# EasyEDA Pro project LNA模块20dB.eprj

# Schematic Schematic1
Board Name: Board1; Create Date: 2025-06-13; Page Name: P1; Project Name: LNA模块20dB; Schematic Name: Schematic1; Update Date: 2025-06-13; Company: 嘉立创EDA; Page Size: A4; Version: V1.0
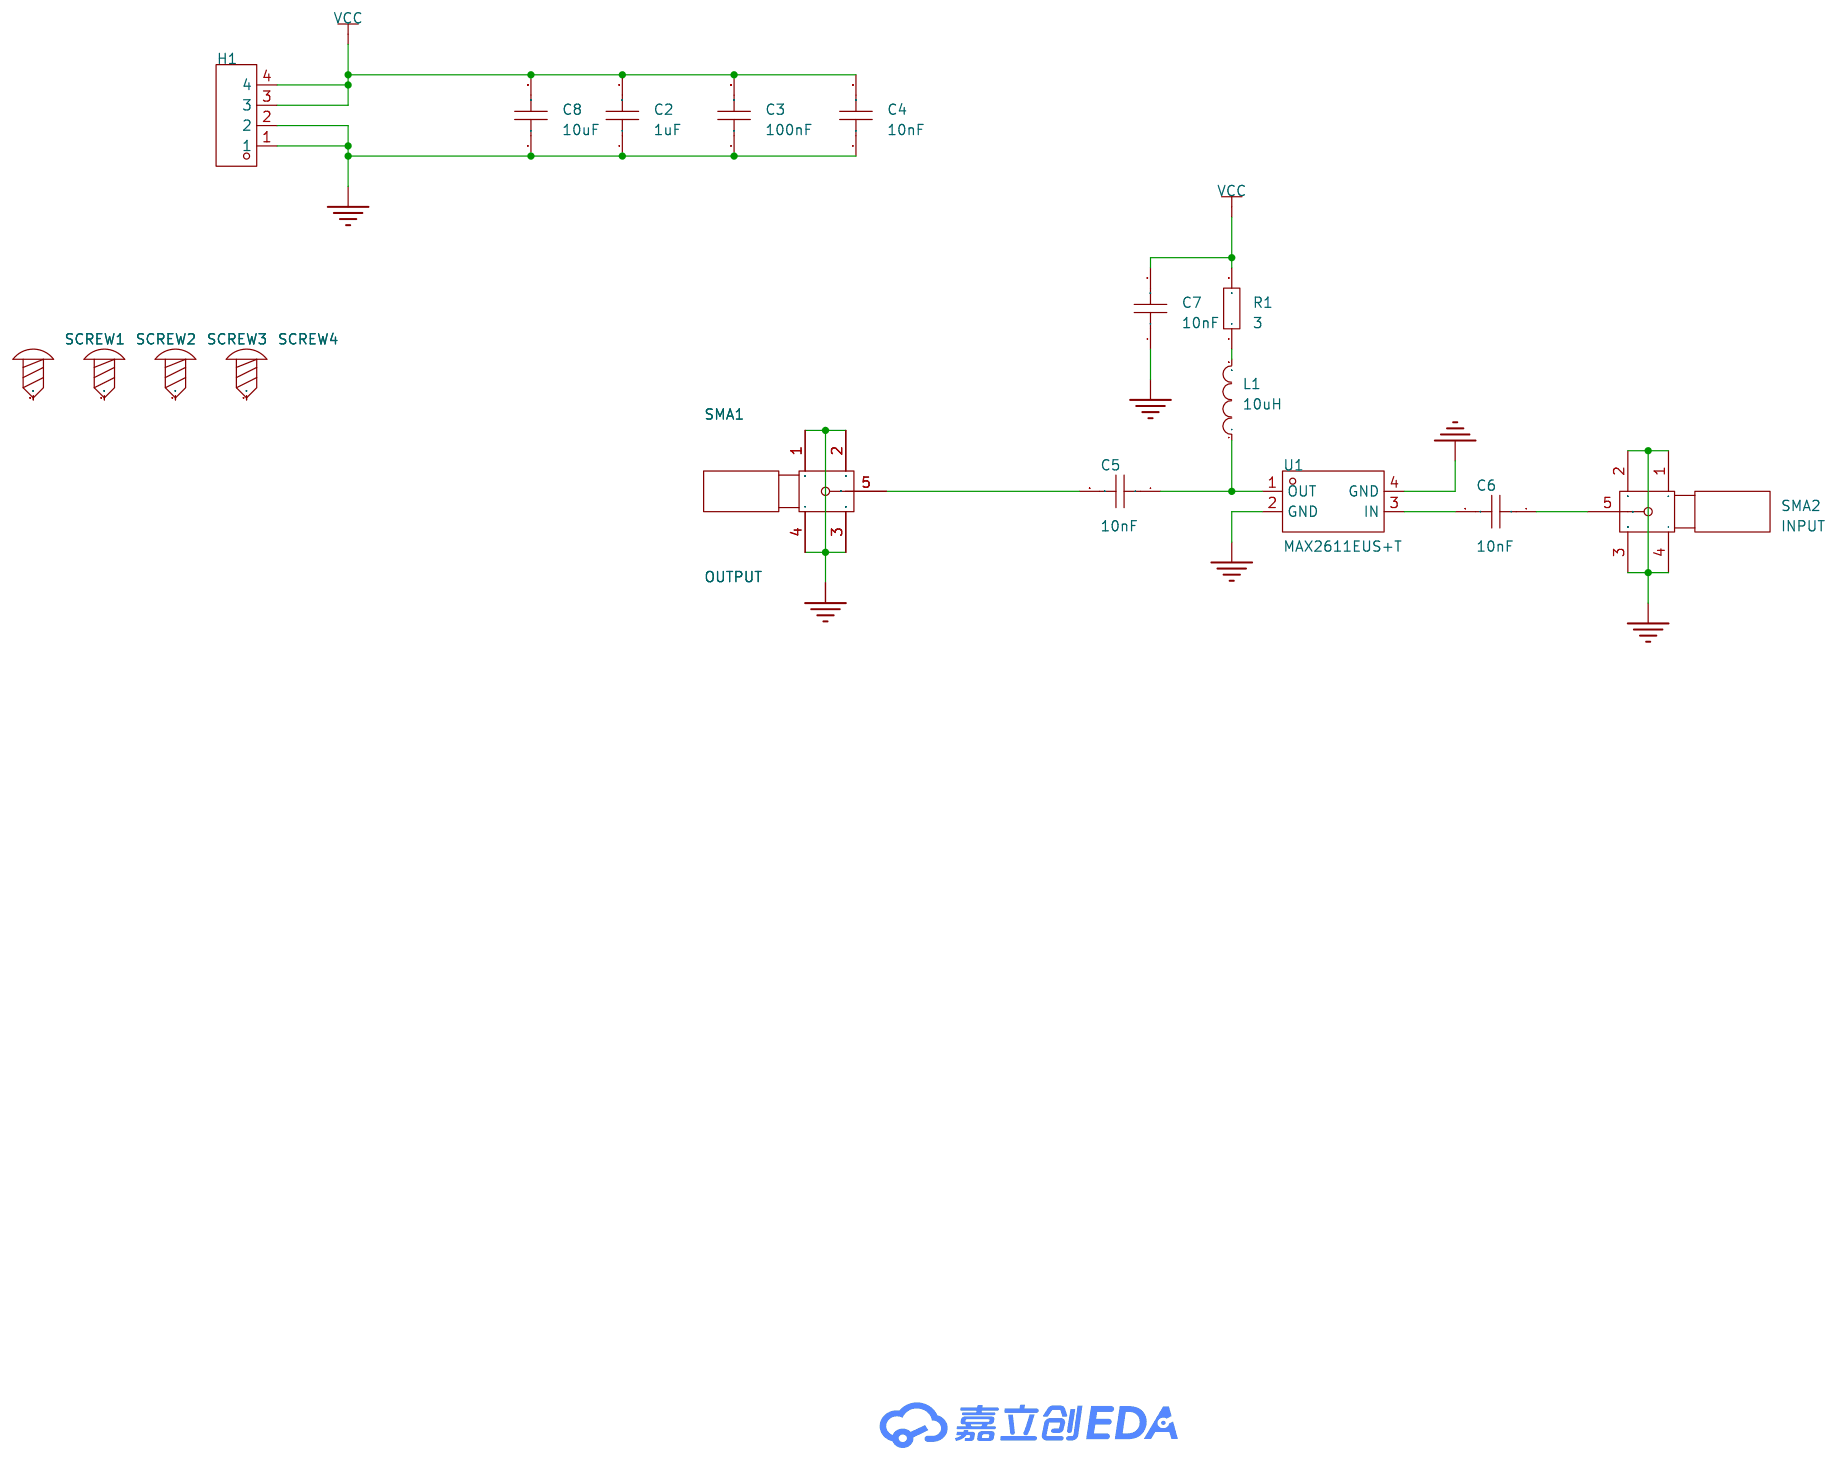
[diagram p0: schematic sheet]

## Parts
C2  1uF  [C0603]
C3  100nF  [C0603]
C4  10nF  [C0603]
C5  10nF  [C0603]
C6  10nF  [C0603]
C7  10nF  [C0603]
C8  10uF  [C0603]
H1  -  [HDR-TH_4P-P2.54-V-M]
L1  10uH  [L0603]
R1  3  [R0603]
SCREW1  -  [M2螺丝]
SCREW2  -  [M2螺丝]
SCREW3  -  [M2螺丝]
SCREW4  -  [M2螺丝]
SMA1  OUTPUT  [SMA-SMD_BWSMA-KE-P001]
SMA2  INPUT  [SMA-SMD_BWSMA-KE-P001]
U1  MAX2611EUS+T  [SOT-143-4_L2.9-W1.3-P1.92-LS2.4-BL]

## Library data of the parts
C2-C8 = CAP_0603: Supplier Footprint: 0603
H1 = HDR-M_2.54_1x4P: Supplier Part: C492403; Supplier Footprint: 插件
L1 = L_0603
R1 = Res_0603: Supplier Footprint: 0603
SCREW1-SCREW4 = M2螺丝: Supplier Footprint: 插件
SMA1 SMA2 = SMA: Supplier Part: C9900018296; JLCPCB Part Class: 扩展库; Supplier: LCSC
U1 = MAX2611EUS+T: 应用领域:GPS；WLL；机顶盒；ISM；PCS；WLAN;频率:0Hz~1.1GHz;增益:18.3dB;; LCSC Part Name: 直流至微波低噪声放大器; Supplier Part: C559510; Manufacturer: ADI(亚德诺)/MAXIM(美信); Supplier Footprint: SOT-143-4; JLCPCB Part Class: 扩展库; Datasheet: https://atta.szlcsc.com/upload/public/pdf/source/20221121/80FC9B3F2BA7D7E9490E24CACEDB6FF3.pdf; Supplier: LCSC; Applications: GPS；WLL；机顶盒；ISM；PCS；WLAN; Frequency Range: 0Hz~1.1GHz; Gain: 18.3dB; Voltage - Supply: 5V; Current - Supply: 16mA

## Nets
GND: C2.1 C3.1 C4.1 C7.1 C8.1 H1.1 H1.2 SMA1.1 SMA1.2 SMA1.3 SMA1.4 SMA2.1 SMA2.2 SMA2.3 SMA2.4 U1.2(GND) U1.4(GND)
VCC: C2.2 C3.2 C4.2 C7.2 C8.2 H1.3 H1.4 R1.2
$1N726: L1.2 R1.1
$1N735: C5.1 L1.1 U1.1(OUT)
$1N837: C6.2 U1.3(IN)
Net-(C5-2): C5.2 SMA1.5
Net-(C6-1): C6.1 SMA2.5

Not connected (* = marked no-connect by the designer): SCREW1 1; SCREW2 1; SCREW3 1; SCREW4 1

# Board PCB1
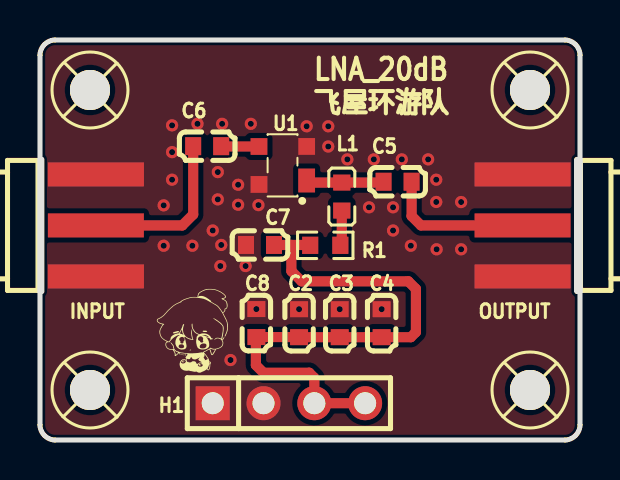
[diagram p1: board, top side]
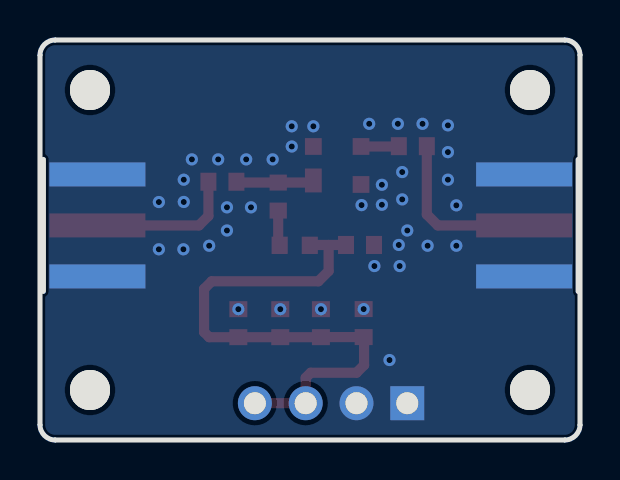
[diagram p2: board, bottom side, seen from below]

Outline 27 x 20 mm; copper layers: Top Layer, Bottom Layer. Coordinates in mm from the lower left corner of the outline.
Outline path: 0,19.24 0,0.76 arc(0.22,0.22) 0.76,0 26.24,0 arc(26.78,0.22) 27,0.76 27,19.24 arc(26.78,19.78) 26.24,20 0.76,20 arc(0.22,19.78) 0,19.24
Stack: Top Layer 0.035mm / Dielectric1 1.51mm FR4 er 4.5 / Bottom Layer 0.035mm

## Design rules (mm)
template: 自定义配置
spacing copperThickness1oz (default): track to track 0.102, other pairs 0.152 to 0.3
spacing copperThickness2oz: track to track 0.203, other pairs 0.152 to 0.3
track width copperThickness1oz (default): min 0.127, default 0.254, max 2.54
track width copperThickness2oz: min 0.203, default 0.254, max 2.54
differential pair differentialPair (default): width min 0.127, default 0.254, max 2.54; gap min 0.152, default 0.152
via viaSize (default): diameter min 0.5, default 0.61, max 10; hole min 0.3, default 0.305, max 6.3
pour e158 uses copperRegion
pour e232 uses copperRegion

## Placement (name value [footprint] x y rotation side)
C2  1uF  [C0603]  12.95 5.84 270 top
C3  100nF  [C0603]  14.99 5.84 270 top
C4  10nF  [C0603]  17.08 5.84 270 top
C5  10nF  [C0603]  17.88 12.91 0 top
C6  10nF  [C0603]  8.36 14.69 0 top
C7  10nF  [C0603]  11 9.75 0 top
C8  10uF  [C0603]  10.82 5.85 270 top
H1  -  [HDR-TH_4P-P2.54-V-M]  12.45 1.84 0 top
INPUT  INPUT  [SMA-SMD_BWSMA-KE-P001]  2.79 10.73 180 top
L1  10uH  [L0603]  15.09 12.17 270 top
OUTPUT  OUTPUT  [SMA-SMD_BWSMA-KE-P001]  24.13 10.73 0 top
R1  3  [R0603]  14.26 9.73 180 top
SCREW1  -  [M2螺丝]  2.5 17.5 0 top
SCREW2  -  [M2螺丝]  24.5 17.5 0 top
SCREW3  -  [M2螺丝]  2.5 2.5 0 top
SCREW4  -  [M2螺丝]  24.5 2.5 0 top
U1  MAX2611EUS+T  [SOT-143-4_L2.9-W1.3-P1.92-LS2.4-BL]  12.14 13.73 90 top

## Footprints (pads in the part's own frame, mm; a bottom-side part is the same pattern mirrored in y, then rotated)
C0603
  rect 0.8x0.9 smd: 1(-0.7,0) 2(0.7,0)
HDR-TH_4P-P2.54-V-M
  rect 1.7x1.7 hole 1.1: 1(-3.81,0)
  round 1.7 hole 1.1: 2(-1.27,0) 3(1.27,0) 4(3.81,0)
L0603
  rect 0.8x0.864 smd: 1(-0.7,0) 2(0.7,0)
M2螺丝
  round 2 hole 2: 1(0,0)
R0603
  rect 0.806x0.864 smd: 1(-0.753,0) 2(0.753,0)
SMA-SMD_BWSMA-KE-P001
  rect 4.8x1.2 smd: 1(0,-2.55) 2(0,2.55) 5(0,0)
  rect 4.8x1.2 smd far side: 3(0,2.55) 4(0,-2.55)
SOT-143-4_L2.9-W1.3-P1.92-LS2.4-BL
  rect 1.194x0.838 smd: 1(-0.75,-1.192)
  rect 0.838x0.838 smd: 2(0.95,-1.192) 3(0.95,1.192) 4(-0.95,1.192)

## Nets
GND: C2.1 C3.1 C4.1 C7.1 C8.1 H1.1 H1.2 INPUT.1 INPUT.2 INPUT.3 INPUT.4 OUTPUT.1 OUTPUT.2 OUTPUT.3 OUTPUT.4 U1.2 U1.4
VCC: C2.2 C3.2 C4.2 C7.2 C8.2 H1.3 H1.4 R1.2
$1N726: L1.2 R1.1
$1N735: C5.1 L1.1 U1.1
$1N837: C6.2 U1.3
$1N919: C5.2 OUTPUT.5
$1N1030: C6.1 INPUT.5

Pads without a net: SCREW1 1; SCREW2 1; SCREW3 1; SCREW4 1

## Via types
v1: diameter 0.61, hole 0.305, Top Layer to Bottom Layer, 39 vias

## Routing (per net, layer and track width the routed paths; a pad name or vN(x,y) marks a point on that pad's centre or on a via; arc(x,y) is an arc through that point)
GND:
  vias: v1(6.18,11.73) v1(6.18,9.71) v1(6.6,15.73) v1(6.6,14.39) v1(6.6,13.02) v1(7.62,9.71) v1(7.87,15.81) v1(8.64,10.47) v1(8.89,13.4) v1(8.89,12.03) v1(9.02,8.7) v1(9.11,15.81) v1(9.06,9.75) v1(9.53,4) v1(9.91,12.76) v1(9.91,11.76) v1(10.28,8.7) v1(10.54,15.81) v1(10.82,6.55) v1(10.92,11.75) v1(12.95,6.54) v1(13.33,15.69) v1(14.41,15.69) v1(14.41,14.67) v1(14.99,6.54) v1(15.37,14.03) v1(16.45,11.63) v1(16.69,14.03) v1(17.08,6.54) v1(17.65,11.63) v1(17.65,10.47) v1(18.09,14.03) v1(18.54,9.71) v1(19.41,14.03) v1(19.81,13.02) v1(19.81,11.9) v1(19.83,9.53) v1(21.06,11.9) v1(21.06,9.53)
VCC: length 28.4
  Top Layer w0.508: R1.2 13.49,9.75 12.57,9.75 ; 12.57,9.75 12.57,8.45 13.08,7.94 18.41,7.94 18.8,7.55 18.8,5.39 18.54,5.14 C4.2 C3.2 C2.2 12.95,5.15 C8.2 10.79,5.12 10.79,3.74 11.18,3.36 13.46,3.36 13.72,3.11 H1.3 H1.4 ; 12.57,9.75 C7.2
$1N726: length 1.8
  Top Layer w0.508: R1.1 15.09,9.81 L1.2
$1N735: length 3.9
  Top Layer w0.508: U1.1 13.44,12.87 L1.1 17.14,12.87 C5.1
$1N837: length 1.9
  Top Layer w0.508: C6.2 9.07,14.68 U1.3
$1N919: length 7.5
  Top Layer w0.508: OUTPUT.5 19.05,10.73 18.58,11.2 C5.2
$1N1030: length 8.5
  Top Layer w0.508: C6.1 7.66,11.28 7.11,10.73 INPUT.5

## Copper pours and planes (outline as drawn; the poured copper is in the pictures)
GND on Top Layer: -1.91,21.91 29.21,21.91 29.21,-3.24 -1.91,-3.24
GND on Bottom Layer: -0.76,21.27 27.81,21.27 27.81,-2.22 -0.76,-2.22

## Text on the board
Top Silkscreen Layer: LNA_20dB / 飞屋环游队
